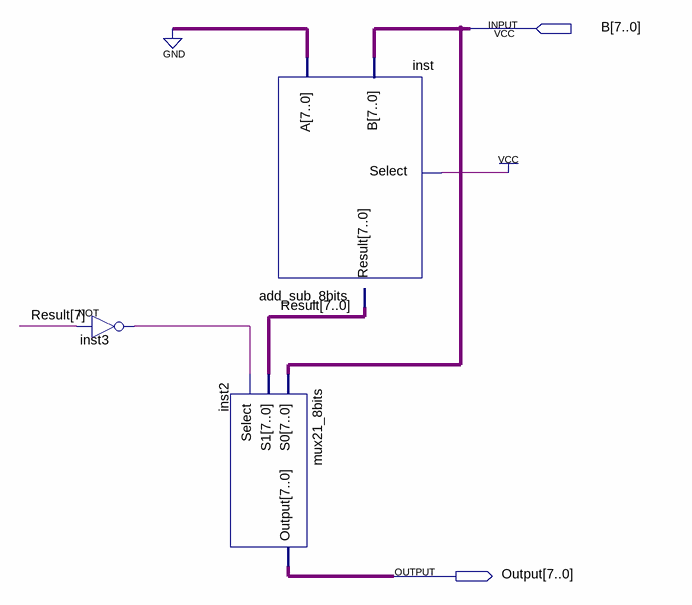
[diagram p0: schematic sheet]
// Quartus schematic Absolute.bdf as structural Verilog: 3 symbols, 2 pins
module Absolute (
  input  [7:0] B,
  output [7:0] Output
);

  wire inst3_out;
  wire [7:0] Result;

  not inst3 (inst3_out, Result[7]);
  mux21_8bits inst2 (.S0(B), .S1(Result), .Select(inst3_out), .Output(Output));
  add_sub_8bits inst (.Select(1'b1), .A({8{1'b0}}), .B(B), .Result(Result));
endmodule
